# Altium schematic sheet SIM CARD.SchDoc: Title
size A4; Date: *******; ApprovedBy: *******; CheckedBy: None; Author: *******; CompanyName: *******; DrawnBy: Name; Engineer: *******; Organization: *******; Address1: *******; Address2: *******; Address3: *******; Address4: *******; DocumentNumber: 4; Revision: *******; SheetNumber: 8; SheetTotal: 9; CurrentTime: *******; CurrentDate: *******; Time: *******; DocumentFullPathAndName: *******; DocumentName: *******; ModifiedDate: *******; ImagePath: *******; ProjectName: *******; Application_BuildNumber: *******
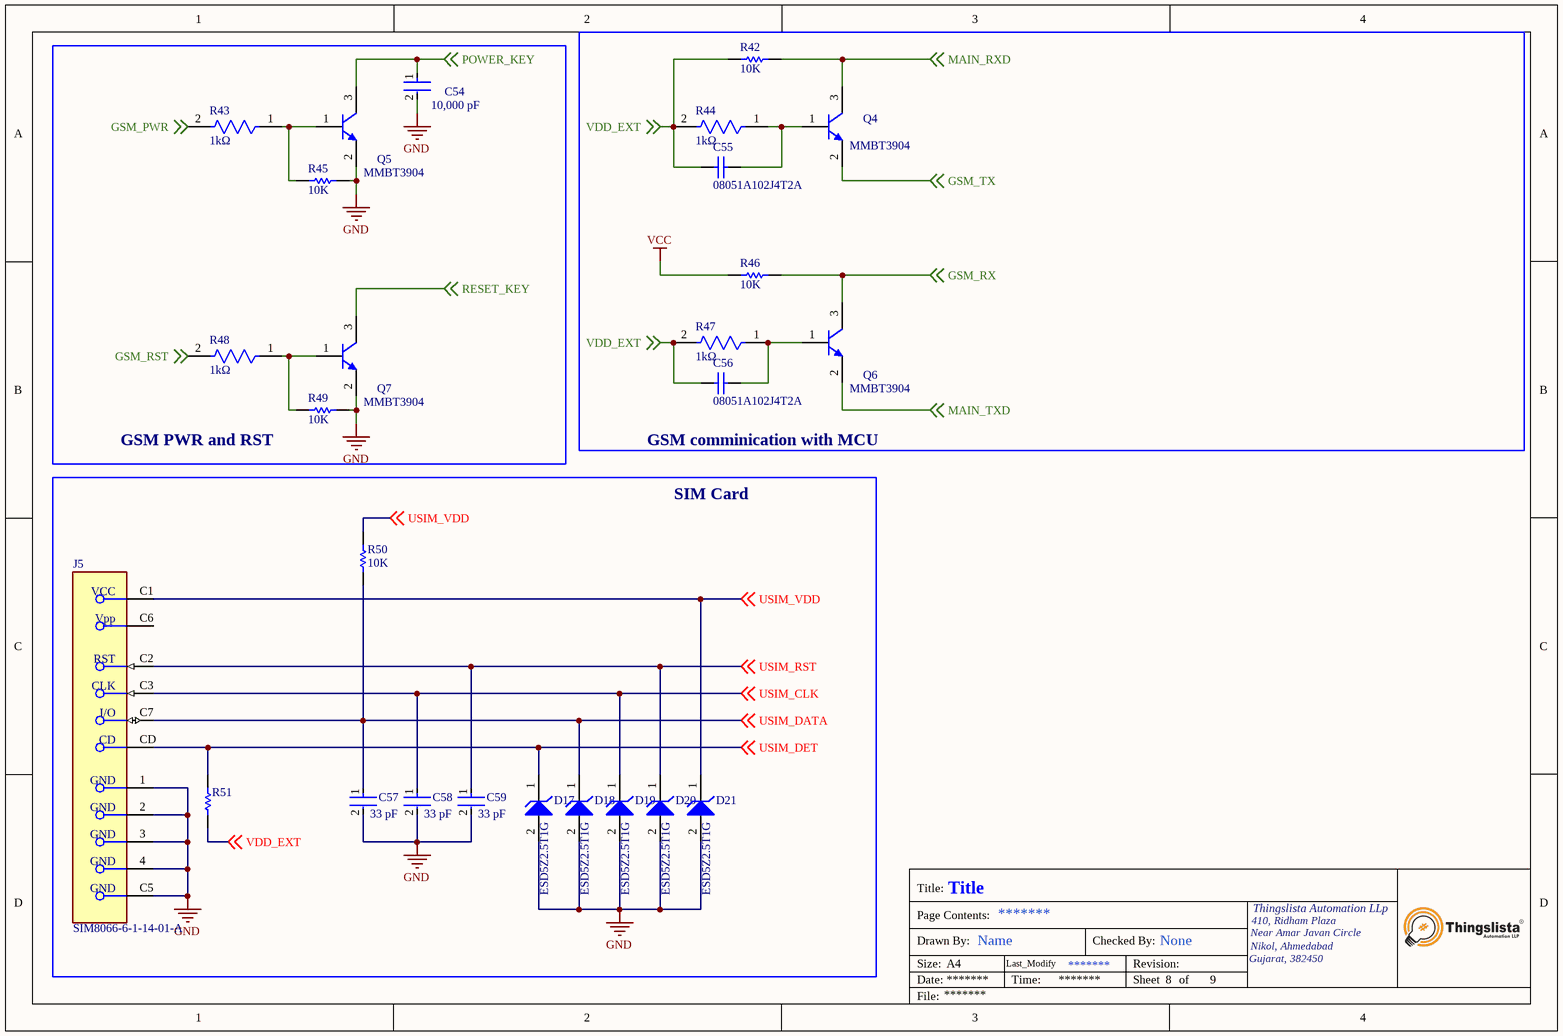
[diagram p0: SIM CARD.SchDoc]

## Parts
C54  value 10,000 pF  [FP-C0805C-DN-MFG]  (hidden comment: C0805C103K2RACTU)
C55  08051A102J4T2A  [CAPC2013X94X50NL20T25]
C56  08051A102J4T2A  [CAPC2013X94X50NL20T25]
C57  value 33 pF  [FP-C1206C-EB-MFG]  (hidden comment: C1206C330M4GACTU)
C58  value 33 pF  [FP-C1206C-EB-MFG]  (hidden comment: C1206C330M4GACTU)
C59  value 33 pF  [FP-C1206C-EB-MFG]  (hidden comment: C1206C330M4GACTU)
D17  ESD5Z2.5T1G  [ONSC-SOD-523-2-502-01_V]
D18  ESD5Z2.5T1G  [ONSC-SOD-523-2-502-01_V]
D19  ESD5Z2.5T1G  [ONSC-SOD-523-2-502-01_V]
D20  ESD5Z2.5T1G  [ONSC-SOD-523-2-502-01_V]
D21  ESD5Z2.5T1G  [ONSC-SOD-523-2-502-01_V]
J5  SIM8066-6-1-14-01-A  [FP-SIM8066-6-1-14-01-A-MFG]
Q4  MMBT3904  [FAIR-SOT23-3_V]
Q5  MMBT3904  [FAIR-SOT23-3_V]
Q6  MMBT3904  [FAIR-SOT23-3_V]
Q7  MMBT3904  [FAIR-SOT23-3_V]
R42  value 10K  [RESC2013X60X35NL10T20]  (hidden comment: RC0805FR-0710KL)
R43  Resistance: 1kΩ  [FP-CRG0805-IPC_A]  (hidden comment: CRG0805F1K0)
R44  Resistance: 1kΩ  [FP-CRG0805-IPC_A]  (hidden comment: CRG0805F1K0)
R45  value 10K  [RESC2013X60X35NL10T20]  (hidden comment: RC0805FR-0710KL)
R46  value 10K  [RESC2013X60X35NL10T20]  (hidden comment: RC0805FR-0710KL)
R47  Resistance: 1kΩ  [FP-CRG0805-IPC_A]  (hidden comment: CRG0805F1K0)
R48  Resistance: 1kΩ  [FP-CRG0805-IPC_A]  (hidden comment: CRG0805F1K0)
R49  value 10K  [RESC2013X60X35NL10T20]  (hidden comment: RC0805FR-0710KL)
R50  value 10K  [RESC2013X60X35NL10T20]  (hidden comment: RC0805FR-0710KL)
R51  CRCW080551K0FKEA  [RESC2013X50X30NL20T20]  (value not drawn)

## Blocks framed on the sheet
GSM PWR and RST: C54 Q5 Q7 R43 R45 R48 R49
GSM comminication with MCU: C55 C56 Q4 Q6 R42 R44 R46 R47
SIM Card: C57-C59 D17-D21 J5 R50 R51

## Nets
GND: C54.2 C57.2 C58.2 C59.2 D17.2(A) D18.2(A) D19.2(A) D20.2(A) D21.2(A) J5.1(GND) J5.2(GND) J5.3(GND) J5.4(GND) J5.C5(GND) Q5.2(E) Q7.2(E) R45.1 R49.1
VCC: R46.2
GSM_PWR: R43.2 ; off-sheet GSM_PWR
GSM_RST: R48.2 ; off-sheet GSM_RST
GSM_RX: Q6.3(C) R46.1 ; off-sheet GSM_RX
GSM_TX: Q4.2(E) ; off-sheet GSM_TX
MAIN_RXD: Q4.3(C) R42.1 ; off-sheet MAIN_RXD
MAIN_TXD: Q6.2(E) ; off-sheet MAIN_TXD
POWER_KEY: C54.1 Q5.3(C) ; off-sheet POWER_KEY
RESET_KEY: Q7.3(C) ; off-sheet RESET_KEY
USIM_CLK: C58.1 D19.1(K) J5.C3(CLK) ; off-sheet USIM_CLK
USIM_DATA: C57.1 D18.1(K) J5.C7(I/O) R50.2 ; off-sheet USIM_DATA
USIM_DET: D17.1(K) J5.CD R51.2 ; off-sheet USIM_DET
USIM_RST: C59.1 D20.1(K) J5.C2(RST) ; off-sheet USIM_RST
USIM_VDD: D21.1(K) J5.C1(VCC) R50.1 ; off-sheet USIM_VDD
VDD_EXT: C55.1 C56.1 R42.2 R44.2 R47.2 R51.1 ; off-sheet VDD_EXT
NetC55_2: C55.2 Q4.1(B) R44.1
NetC56_2: C56.2 Q6.1(B) R47.1
NetQ5_1: Q5.1(B) R43.1 R45.2
NetQ7_1: Q7.1(B) R48.1 R49.2

Not connected (* = marked no-connect by the designer): J5 C6(Vpp)

## Notes on the sheet
- Title:
- Page Contents:
- 410, Ridham Plaza
- Thingslista Automation LLp
- Size:
- Date:
- File:
- Drawn By:
- A4
- Last_Modify
- Time:
- Checked By:
- Revision:
- Sheet
- of
- Gujarat, 382450
- Near Amar Javan Circle
- Nikol, Ahmedabad

## Library data of the parts
C54 = CMP-2007-00259-2: CAP CER 10000PF 200V X7R 0805; Manufacturer: KEMET; Material: Ceramic; Temperature Coefficient: 30ppm/°C; Tolerance: 0.1; Device Class L2: Capacitors; Voltage Rating: 200 V; Temperature Range High: +125°C; ComponentLink2Description: Datasheet; Height: 0.88mm; Octopart: https://octopart.com/c0805c103k2ractu-kemet-9138347; ComponentLink2URL: https://content.kemet.com/datasheets/KEM_C1003_C0G_SMD.pdf; Capacitance: 10,000 pF; Category: Cap; Temperature: -55°C to +125°C; Temperature Range Low: -55°C; Digikey Description: CAP CER 10000PF 200V X7R 0805; Manufacturer Part Number: C0805C103K2RACTU; Temperature Characteristic: X7R; Automotive: No; Device Class L3: Ceramic Capacitors; Mouser Description: KEMET - C0805C103K2RACTU - CAP, MLCC, X7R, 10NF, 200V, 0805; RoHS: TRUE; Device Class L1: Passive Components; Lead Free: Yes; Package: C0805C-DN; Ipc Land Pattern Name: CAPC200125X78
C55 C56 = CMP-2007-04125-1: Manufacturer: AVX Interconnect / Elco; Part Number: 08051A102J4T2A
C57-C59 = CMP-1037-01126-2: CAP CER 33PF 16V NP0 1206; Manufacturer: KEMET; Tolerance: 0.2; Temperature Coefficient: 15%; Automotive Grade: Grade 0; Material: Ceramic; Temperature Characteristic: C0G; Height: 0.88mm; Package: C1206C-EB; Digikey Description: CAP CER 33PF 16V NP0 1206; Device Class L1: Passive Components; ComponentLink2URL: https://content.kemet.com/datasheets/KEM_C1007_X8R_ULTRA_150C_SMD.pdf; Temperature Range High: +150°C; Temperature Range Low: -55°C; Temperature: -55°C to +150°C; Capacitance: 33 pF; Mouser Description: Multilayer Ceramic Capacitors MLCC - SMD/SMT 16volts 33pF C0G 20%; Manufacturer Part Number: C1206C330M4GACTU; Category: Cap; Ipc Land Pattern Name: CAPC320160X78; Device Class L2: Capacitors; ComponentLink2Description: Datasheet; Device Class L3: Ceramic Capacitors; Lead Free: Yes; Automotive: Yes; RoHS: TRUE; Octopart: https://octopart.com/c1206c330m4gactu-kemet-17005893; Voltage Rating: 16 V
D17-D21 = CMP-1063-00103-1: Transient Voltage Suppressor, Micro-Packaged Diode for ESD Protection, 2-Pin SOD-523, Pb-Free, Tape and Reel; Manufacturer: On Semiconductor; Direction: Unidirectional; PPK Max (W): 120; V(BR) Min (V): 4; VRWM Max (V): 2.5; Number of Lines: 1; IR Max (uA): 6; ComponentLink3Description: Package Specification; Packing: Tape and Reel; ComponentLink2URL: http://www.onsemi.cn/pub_link/Collateral/ESD5Z2.5T1-D.PDF; ComponentLink3URL: http://www.onsemi.com/pub_link/Collateral/502-01.PDF; PackageReference: SOD-523-2-502-01; PartNumber: ESD5Z2.5T1G; Mounting Technology: Surface Mount; DatasheetVersion: Rev. 10; PackageVersion: Rev. E, 09/2010; RoHS: Pb-Free; ComponentLink1Description: Manufacturer URL; PackageDescription: 2-Pin SOD, Body 1.2 x 0.8 mm; ComponentLink2Description: Datasheet; ComponentLink1URL: http://www.onsemi.com/
J5 = CMP-03329-117635865-1: SIM8066-6-1-14-01-A Memory Card Connectors 1.44mm Nano SIM Conn w/Peg and Switch; Current Rating: 1A; Number of Contacts: 6; Voltage Rating: 30V; NexarPartId: 117635865; Number of Pins: 6; Min Operating Temperature: -40°C; Max Operating Temperature: 85°C; Contact Material: Gold, Nickel
Q4-Q7 = CMP-1670-00008-1: NPN General Purpose Amplifier, 40 V, 0.2 A, -55 to 150 degC, 3-Pin SOT23, RoHS, Tape and Reel; Tolerance: 30ppm; Capacitance: 1.8E-11 f; Frequency: 12.288 MHz; ESR: 40 Ohm; Load Capacitance: 18 pF; REACH SVHC: No SVHC; Pins: 4; ComponentLink3URL: http://www.fairchildsemi.com/dwg/MA/MA03D.pdf; PackageDescription: 3-Pin Small Outline Transistor, Body 2.92 x 1.325 mm, Pitch 0.95 mm; ComponentLink1URL: https://www.fairchildsemi.com/; Max Operating Temperature: 70degC; PackageReference: SOT23-3; ComponentLink1Description: Manufacturer URL; Width: 0.126 inch; Min Operating Temperature: -20degC; DatasheetVersion: Rev. 1.1.0, 10/2014; Mount: Surface Mount; Height: 0.041 inch; Package Quantity: 1000; Frequency Tolerance: 30ppm; Packaging: Tape and Reel; ComponentLink2URL: https://www.fairchildsemi.com/datasheets/MM/MMBT3904.pdf; RoHSCompliant: True; ComponentLink3Description: Package Specification; ComponentLink2Description: Datasheet; Length: 0.197 inch
R42 R45 R46 R49 R50 = CMP-1659-00013-4: Chip Resistor, 10 KOhm, +/- 1%, 0.125 W, -55 to 155 degC, 0805 (2012 Metric), RoHS, Tape and Reel; Manufacturer: Yageo; Voltage Rating: 150 V; Mount: Surface Mount; ComponentLink1Description: Manufacturer URL; ComponentLink2URL: http://www.yageo.com/documents/recent/PYu-RC_Group_51_RoHS_L_04.pdf; Pins: 2; Length: 2 mm; Min Operating Temperature: -55 degC; Height: 0.5 mm; Mounting Technology: Surface Mount; RoHSCompliant: true; REACH SVHC: No SVHC; ComponentLink1URL: http://www.yageo.com/; Max Operating Temperature: 155 degC; PackageReference: 0805; DatasheetVersion: Rev. 4, 02/2016; Package Quantity: 5000; Packaging: Tape and Reel; ComponentLink2Description: Datasheet; PackageDescription: 2-Pin Surface Mounted Device, Body 2 x 1.25 mm
R43 R44 R47 R48 = CMP-03790-16077480-1: CRG0805F1K0 Thick Film Resistors - SMD 1K Ohm 1% 1/8W Res Thick Film 0805; Manufacturer Lifecycle Status: ACTIVE; Max Power Dissipation: 125mW; Voltage Rating: 150V; Number of Resistors: 1; Temperature Coefficient: 100ppm/°C; ELV: Compliant; Case/Package: 0805; Number of Terminations: 2; Termination: SMD/SMT, Solder; Composition: Thick Film; Voltage Rating (DC): 150V; Min Operating Temperature: -55°C; Tolerance: 1%; Case Code (Imperial): 0805; Power Rating: 125mW; Schedule B: 8533210045, 8533210090, 8533210090; Case Code (Metric): 2012; NexarPartId: 16077480; Packaging: Tape and Reel; Lifecycle Status: Production; Depth: 1.25mm; Mount: Surface Mount; Weight: 5.499807mg; Radiation Hardening: No; Max Operating Temperature: 125°C; Width: 1.2446mm; Length: 2mm; Military Standard: Not; RoHS: Compliant; Height: 550µm
R51 = CMP-2001-03993-1: Manufacturer: Vishay Dale; Value: 51K; Part Number: CRCW080551K0FKEA